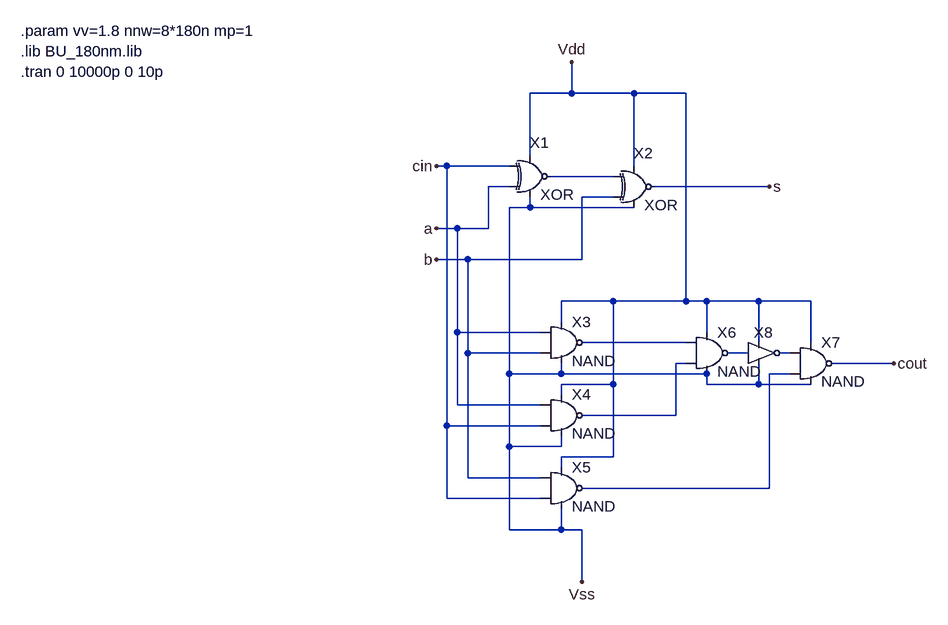
[diagram p0: schematic add1b.asc]
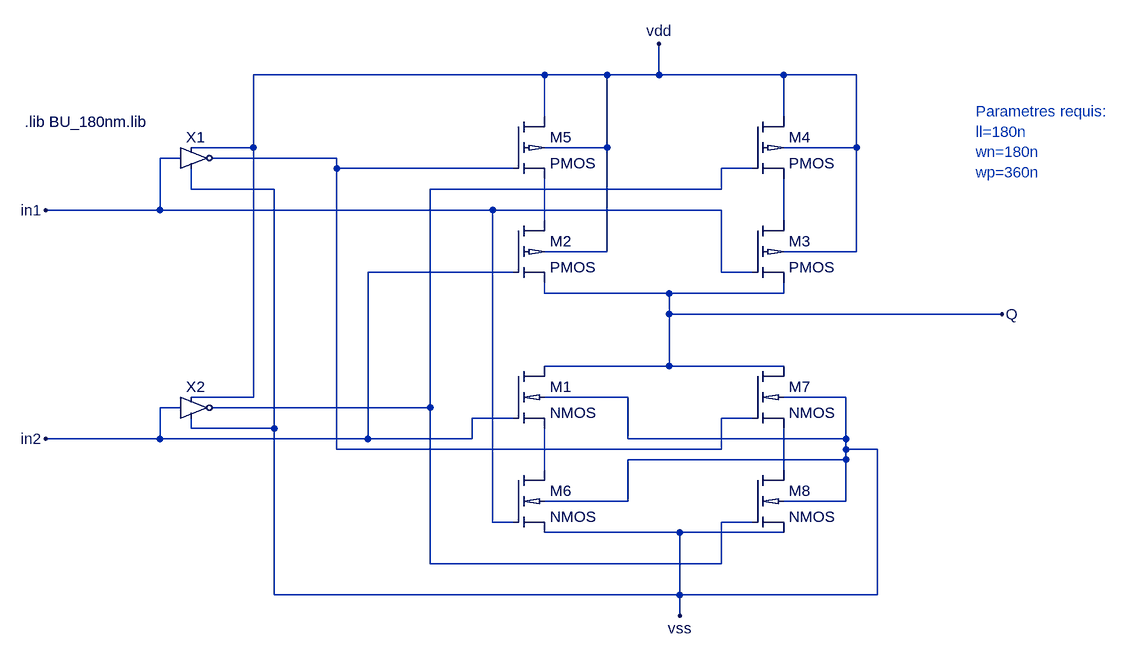
[diagram p1: sub-circuit xor.asc]
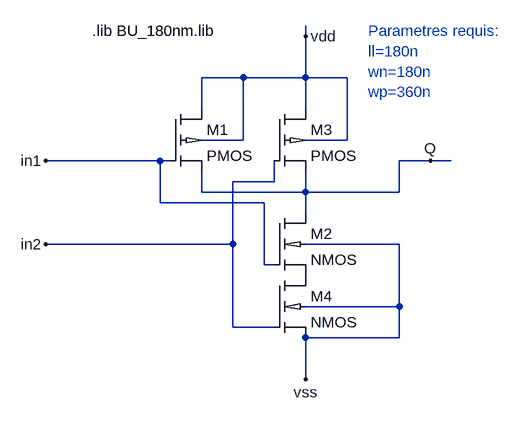
[diagram p2: sub-circuit nand.asc]
add1b.asc, the LTspice schematic file:
Version 4
SHEET 1 880 756
WIRE 272 -80 272 -128
WIRE 272 -80 208 -80
WIRE 368 -80 272 -80
WIRE 448 -80 368 -80
WIRE 208 16 208 -80
WIRE 80 32 64 32
WIRE 176 32 80 32
WIRE 368 32 368 -80
WIRE 336 48 240 48
WIRE 176 64 144 64
WIRE 576 64 400 64
WIRE 336 80 288 80
WIRE 208 96 208 80
WIRE 208 96 176 96
WIRE 368 96 208 96
WIRE 96 128 64 128
WIRE 144 128 144 64
WIRE 144 128 96 128
WIRE 112 176 64 176
WIRE 288 176 288 80
WIRE 288 176 112 176
WIRE 336 240 256 240
WIRE 448 240 448 -80
WIRE 448 240 336 240
WIRE 480 240 448 240
WIRE 560 240 480 240
WIRE 640 240 560 240
WIRE 256 272 256 240
WIRE 96 288 96 128
WIRE 224 288 96 288
WIRE 480 288 480 240
WIRE 448 304 288 304
WIRE 560 304 560 240
WIRE 640 304 640 240
WIRE 112 320 112 176
WIRE 224 320 112 320
WIRE 544 320 512 320
WIRE 608 320 592 320
WIRE 448 336 432 336
WIRE 768 336 672 336
WIRE 176 352 176 96
WIRE 256 352 256 336
WIRE 256 352 176 352
WIRE 480 352 256 352
WIRE 608 352 576 352
WIRE 336 368 336 240
WIRE 336 368 256 368
WIRE 480 368 480 352
WIRE 560 368 560 336
WIRE 560 368 480 368
WIRE 640 368 560 368
WIRE 256 384 256 368
WIRE 96 400 96 288
WIRE 224 400 96 400
WIRE 432 416 432 336
WIRE 432 416 288 416
WIRE 80 432 80 32
WIRE 224 432 80 432
WIRE 176 464 176 352
WIRE 256 464 256 448
WIRE 256 464 176 464
WIRE 336 480 336 368
WIRE 336 480 256 480
WIRE 256 496 256 480
WIRE 112 512 112 320
WIRE 224 512 112 512
WIRE 576 528 576 352
WIRE 576 528 288 528
WIRE 80 544 80 432
WIRE 224 544 80 544
WIRE 176 592 176 464
WIRE 256 592 256 560
WIRE 256 592 176 592
WIRE 288 592 256 592
WIRE 288 672 288 592
FLAG 64 128 a
FLAG 64 176 b
FLAG 64 32 cin
FLAG 272 -128 Vdd
FLAG 288 672 Vss
FLAG 576 64 s
FLAG 768 336 cout
SYMBOL xor 208 48 R0
SYMATTR InstName X1
SYMATTR SpiceLine ll=180n wn={nnw} wp={nnw*mp}
SYMBOL xor 368 64 R0
SYMATTR InstName X2
SYMATTR SpiceLine ll=180n wn={nnw} wp={nnw*mp}
SYMBOL nand 256 304 R0
SYMATTR InstName X3
SYMATTR SpiceLine ll=180n wn={nnw} wp={nnw*mp}
SYMBOL nand 256 416 R0
SYMATTR InstName X4
SYMATTR SpiceLine ll=180n wn={nnw} wp={nnw*mp}
SYMBOL nand 256 528 R0
SYMATTR InstName X5
SYMATTR SpiceLine ll=180n wn={nnw} wp={nnw*mp}
SYMBOL nand 480 320 R0
SYMATTR InstName X6
SYMATTR SpiceLine ll=180n wn={nnw} wp={nnw*mp}
SYMBOL nand 640 336 R0
SYMATTR InstName X7
SYMATTR SpiceLine ll=180n wn={nnw} wp={nnw*mp}
SYMBOL inv 560 320 R0
SYMATTR InstName X8
SYMATTR SpiceLine ll=180n wn={nnw} wp={nnw*mp}
TEXT -576 -176 Left 2 !.param vv=1.8 nnw=8*180n mp=1\n.lib BU_180nm.lib\n.tran 0 10000p 0 10p

xor.asc, the sub-circuit schematic file:
Version 4
SHEET 1 1192 916
WIRE 144 0 -304 0
WIRE 240 0 144 0
WIRE 320 0 320 -48
WIRE 320 0 240 0
WIRE 512 0 320 0
WIRE 624 0 512 0
WIRE 144 64 144 0
WIRE 512 64 512 0
WIRE -304 112 -304 0
WIRE -304 112 -400 112
WIRE 240 112 240 0
WIRE 240 112 144 112
WIRE 624 112 624 0
WIRE 624 112 512 112
WIRE -416 128 -448 128
WIRE -176 128 -368 128
WIRE -176 144 -176 128
WIRE 96 144 -176 144
WIRE 464 144 416 144
WIRE -400 176 -400 144
WIRE -272 176 -400 176
WIRE 416 176 416 144
WIRE 416 176 -32 176
WIRE -448 208 -448 128
WIRE -448 208 -624 208
WIRE 64 208 -448 208
WIRE 416 208 64 208
WIRE 144 224 144 160
WIRE 512 224 512 160
WIRE 240 272 240 112
WIRE 240 272 144 272
WIRE 624 272 624 112
WIRE 624 272 512 272
WIRE 96 304 -128 304
WIRE 416 304 416 208
WIRE 464 304 416 304
WIRE 144 336 144 320
WIRE 336 336 144 336
WIRE 512 336 512 320
WIRE 512 336 336 336
WIRE 336 368 336 336
WIRE 848 368 336 368
WIRE 336 448 336 368
WIRE 336 448 144 448
WIRE 512 448 336 448
WIRE -304 496 -304 112
WIRE -304 496 -400 496
WIRE 272 496 144 496
WIRE 608 496 512 496
WIRE -416 512 -448 512
WIRE -32 512 -32 176
WIRE -32 512 -368 512
WIRE 96 528 32 528
WIRE 464 528 416 528
WIRE -400 544 -400 528
WIRE -272 544 -272 176
WIRE -272 544 -400 544
WIRE -448 560 -448 512
WIRE -448 560 -624 560
WIRE -128 560 -128 304
WIRE -128 560 -448 560
WIRE 32 560 32 528
WIRE 32 560 -128 560
WIRE 272 560 272 496
WIRE 608 560 608 496
WIRE 608 560 272 560
WIRE -176 576 -176 144
WIRE 416 576 416 528
WIRE 416 576 -176 576
WIRE 608 576 608 560
WIRE 656 576 608 576
WIRE 608 592 608 576
WIRE 608 592 272 592
WIRE 144 608 144 544
WIRE 512 608 512 544
WIRE 272 656 272 592
WIRE 272 656 144 656
WIRE 608 656 608 592
WIRE 608 656 512 656
WIRE 64 688 64 208
WIRE 96 688 64 688
WIRE 464 688 416 688
WIRE 352 704 144 704
WIRE 512 704 352 704
WIRE -32 752 -32 512
WIRE 416 752 416 688
WIRE 416 752 -32 752
WIRE -272 800 -272 544
WIRE 352 800 352 704
WIRE 352 800 -272 800
WIRE 656 800 656 576
WIRE 656 800 352 800
WIRE 352 832 352 800
FLAG -624 208 in1
FLAG -624 560 in2
FLAG 352 832 vss
FLAG 320 -48 vdd
FLAG 848 368 Q
SYMBOL pmos018 464 224 R0
SYMATTR InstName M3
SYMATTR Value2 l={ll} w={wp} ad={450n*{wp}} as={450n*{wp}} pd={900n+{wp}} ps={1080n+{wp}}
SYMBOL pmos018 464 64 R0
SYMATTR InstName M4
SYMATTR Value2 l={ll} w={wp} ad={450n*{wp}} as={450n*{wp}} pd={900n+{wp}} ps={1080n+{wp}}
SYMBOL pmos018 96 64 R0
SYMATTR InstName M5
SYMATTR Value2 l={ll} w={wp} ad={450n*{wp}} as={450n*{wp}} pd={900n+{wp}} ps={1080n+{wp}}
SYMBOL nmos018 96 608 R0
SYMATTR InstName M6
SYMATTR Value2 l={ll} w={wn} ad={450n*{wn}} as={450n*{wn}} pd={900n+{wn}} ps={1080n+{wn}}
SYMBOL nmos018 464 448 R0
SYMATTR InstName M7
SYMATTR Value2 l={ll} w={wn} ad={450n*{wn}} as={450n*{wn}} pd={900n+{wn}} ps={1080n+{wn}}
SYMBOL nmos018 464 608 R0
SYMATTR InstName M8
SYMATTR Value2 l={ll} w={wn} ad={450n*{wn}} as={450n*{wn}} pd={900n+{wn}} ps={1080n+{wn}}
SYMBOL inv -400 128 R0
SYMATTR InstName X1
SYMATTR SpiceLine ll=180n wn={nnw} wp={nnw*mp}
SYMBOL inv -400 512 R0
SYMATTR InstName X2
SYMATTR SpiceLine ll=180n wn={nnw} wp={nnw*mp}
SYMBOL nmos018 96 448 R0
SYMATTR InstName M1
SYMATTR Value2 l={ll} w={wn} ad={450n*{wn}} as={450n*{wn}} pd={900n+{wn}} ps={1080n+{wn}}
SYMBOL pmos018 96 224 R0
SYMATTR InstName M2
SYMATTR Value2 l={ll} w={wp} ad={450n*{wp}} as={450n*{wp}} pd={900n+{wp}} ps={1080n+{wp}}
TEXT -656 72 Left 2 !.lib BU_180nm.lib
TEXT 808 56 Left 2 ;Parametres requis: \nll=180n\nwn=180n  \nwp=360n

nand.asc, the sub-circuit schematic file:
Version 4
SHEET 1 1192 788
WIRE 448 176 448 160
WIRE 352 240 288 240
WIRE 448 240 448 176
WIRE 448 240 352 240
WIRE 512 240 448 240
WIRE 288 288 288 240
WIRE 448 288 448 240
WIRE 352 336 352 240
WIRE 352 336 288 336
WIRE 512 336 512 240
WIRE 512 336 448 336
WIRE 224 368 48 368
WIRE 240 368 224 368
WIRE 640 368 592 368
WIRE 672 368 640 368
WIRE 400 400 400 368
WIRE 400 400 336 400
WIRE 288 416 288 384
WIRE 448 416 448 384
WIRE 448 416 288 416
WIRE 592 416 592 368
WIRE 592 416 448 416
WIRE 224 432 224 368
WIRE 384 432 224 432
WIRE 448 448 448 416
WIRE 336 496 336 400
WIRE 336 496 48 496
WIRE 592 496 448 496
WIRE 384 528 384 432
WIRE 400 528 384 528
WIRE 592 592 592 496
WIRE 592 592 448 592
WIRE 336 624 336 496
WIRE 400 624 336 624
WIRE 592 640 592 592
WIRE 592 640 448 640
WIRE 448 704 448 640
FLAG 448 176 vdd
FLAG 448 704 vss
FLAG 640 368 Q
FLAG 48 368 in1
FLAG 48 496 in2
SYMBOL pmos018 240 288 R0
SYMATTR InstName M1
SYMATTR Value2 l={ll} w={wp} ad={450n*{wp}} as={450n*{wp}} pd={900n+{wp}} ps={1080n+{wp}}
SYMBOL nmos018 400 448 R0
SYMATTR InstName M2
SYMATTR Value2 l={ll} w={wn} ad={450n*{wn}} as={450n*{wn}} pd={900n+{wn}} ps={1080n+{wn}}
SYMBOL pmos018 400 288 R0
SYMATTR InstName M3
SYMATTR Value2 l={ll} w={wp} ad={450n*{wp}} as={450n*{wp}} pd={900n+{wp}} ps={1080n+{wp}}
SYMBOL nmos018 400 544 R0
SYMATTR InstName M4
SYMATTR Value2 l={ll} w={wn} ad={450n*{wn}} as={450n*{wn}} pd={900n+{wn}} ps={1080n+{wn}}
TEXT 120 168 Left 2 !.lib BU_180nm.lib
TEXT 544 168 Left 2 ;Parametres requis: \nll=180n\nwn=180n \nwp=360n

The netlist it stands for:
* add1b.asc
XX1 cin N001 Vdd Vss a xor params: XOR ll=180n wn={nnw} wp={nnw*mp}
XX2 N001 s Vdd Vss b xor params: XOR ll=180n wn={nnw} wp={nnw*mp}
XX3 a N002 Vdd Vss b nand params: NAND ll=180n wn={nnw} wp={nnw*mp}
XX4 a N005 Vdd Vss cin nand params: NAND ll=180n wn={nnw} wp={nnw*mp}
XX5 b N006 Vdd Vss cin nand params: NAND ll=180n wn={nnw} wp={nnw*mp}
XX6 N002 N003 Vdd Vss N005 nand params: NAND ll=180n wn={nnw} wp={nnw*mp}
XX7 N004 cout Vdd Vss N006 nand params: NAND ll=180n wn={nnw} wp={nnw*mp}
XX8 N003 N004 Vdd Vss inv ll=180n wn={nnw} wp={nnw*mp}  ; pins In _Q vdd vss

* block symbol definitions
.subckt xor in1 Q vdd vss in2
M3 N004 in1 Q vdd PMOS l={ll} w={wp} ad={450n*{wp}} as={450n*{wp}} pd={900n+{wp}} ps={1080n+{wp}}
M4 vdd N002 N004 vdd PMOS l={ll} w={wp} ad={450n*{wp}} as={450n*{wp}} pd={900n+{wp}} ps={1080n+{wp}}
M5 vdd N001 N003 vdd PMOS l={ll} w={wp} ad={450n*{wp}} as={450n*{wp}} pd={900n+{wp}} ps={1080n+{wp}}
M6 N005 in1 vss vss NMOS l={ll} w={wn} ad={450n*{wn}} as={450n*{wn}} pd={900n+{wn}} ps={1080n+{wn}}
M7 Q N001 N006 vss NMOS l={ll} w={wn} ad={450n*{wn}} as={450n*{wn}} pd={900n+{wn}} ps={1080n+{wn}}
M8 N006 N002 vss vss NMOS l={ll} w={wn} ad={450n*{wn}} as={450n*{wn}} pd={900n+{wn}} ps={1080n+{wn}}
XX1 in1 N001 vdd vss inv ll=180n wn={nnw} wp={nnw*mp}  ; pins In _Q vdd vss
XX2 in2 N002 vdd vss inv ll=180n wn={nnw} wp={nnw*mp}  ; pins In _Q vdd vss
M1 Q in2 N005 vss NMOS l={ll} w={wn} ad={450n*{wn}} as={450n*{wn}} pd={900n+{wn}} ps={1080n+{wn}}
M2 N003 in2 Q vdd PMOS l={ll} w={wp} ad={450n*{wp}} as={450n*{wp}} pd={900n+{wp}} ps={1080n+{wp}}
.lib BU_180nm.lib
* Parametres requis:
* ll=180n
* wn=180n
* wp=360n
.ends xor

.subckt nand in1 Q vdd vss in2
M1 vdd in1 Q vdd PMOS l={ll} w={wp} ad={450n*{wp}} as={450n*{wp}} pd={900n+{wp}} ps={1080n+{wp}}
M2 Q in1 P001 vss NMOS l={ll} w={wn} ad={450n*{wn}} as={450n*{wn}} pd={900n+{wn}} ps={1080n+{wn}}
M3 vdd in2 Q vdd PMOS l={ll} w={wp} ad={450n*{wp}} as={450n*{wp}} pd={900n+{wp}} ps={1080n+{wp}}
M4 P001 in2 vss vss NMOS l={ll} w={wn} ad={450n*{wn}} as={450n*{wn}} pd={900n+{wn}} ps={1080n+{wn}}
.lib BU_180nm.lib
* Parametres requis:
* ll=180n
* wn=180n
* wp=360n
.ends nand

.model NMOS NMOS
.model PMOS PMOS
.lib standard.mos
.param vv=1.8 nnw=8*180n mp=1
.lib BU_180nm.lib
.tran 0 10000p 0 10p
.lib BU_180nm.lib
.backanno
.end